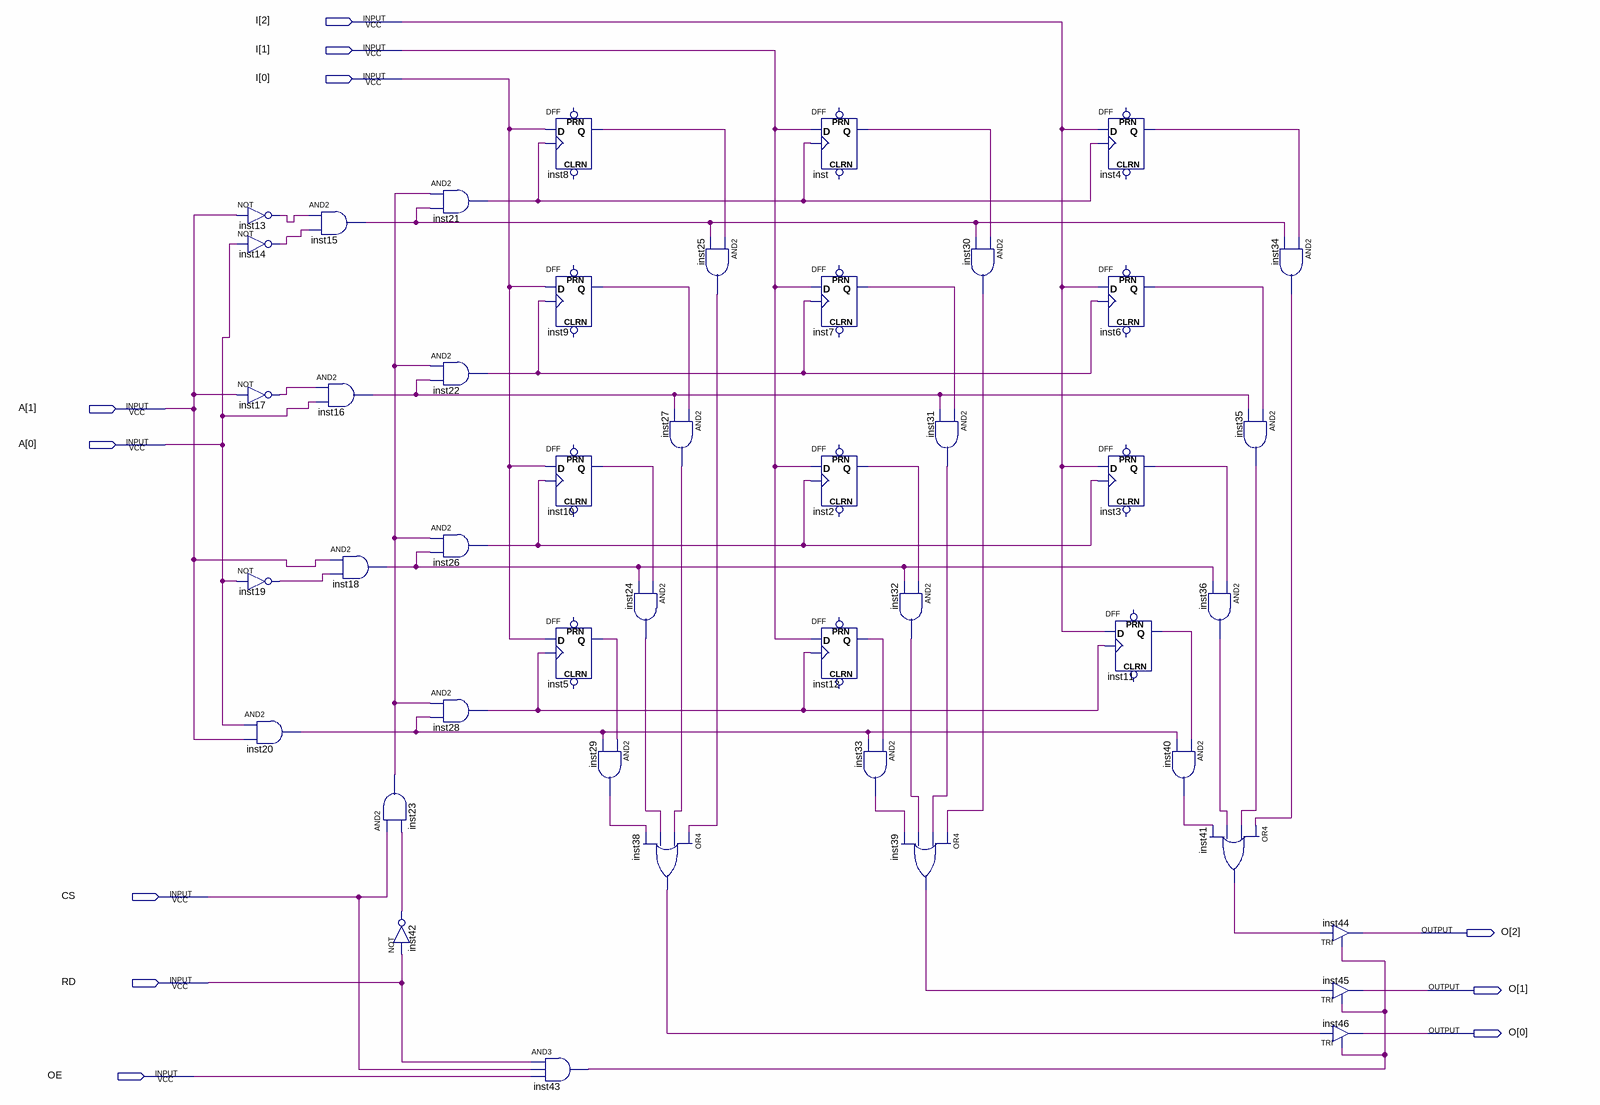
[diagram p0: schematic sheet]
// Quartus schematic MEM_4x3.bdf as structural Verilog: 45 symbols, 11 pins
module MEM_4x3 (
  input  [2:0] I,
  input  [1:0] A,
  input  CS,
  input  RD,
  input  OE,
  output [2:0] O
);

  wire inst2_q, inst3_q, inst4_q, inst5_q, inst6_q, inst7_q, inst8_q, inst9_q, inst10_q, inst11_q, inst12_q,
       inst13_out, inst14_out, inst15_out, inst16_out, inst17_out, inst18_out, inst19_out, inst20_out,
       inst21_out, inst22_out, inst23_out, inst24_out, inst25_out, inst26_out, inst27_out, inst28_out,
       inst29_out, inst30_out, inst31_out, inst32_out, inst33_out, inst34_out, inst35_out, inst36_out,
       inst38_out, inst39_out, inst40_out, inst41_out, inst42_out, inst43_out, inst_q;

  not inst13 (inst13_out, A[1]);
  not inst14 (inst14_out, A[0]);
  not inst17 (inst17_out, A[1]);
  not inst19 (inst19_out, A[0]);
  and inst20 (inst20_out, A[0], A[1]);
  and inst15 (inst15_out, inst13_out, inst14_out);
  and inst16 (inst16_out, inst17_out, A[0]);
  and inst18 (inst18_out, A[1], inst19_out);
  and inst23 (inst23_out, CS, inst42_out);
  and inst21 (inst21_out, inst23_out, inst15_out);
  and inst22 (inst22_out, inst23_out, inst16_out);
  and inst26 (inst26_out, inst23_out, inst18_out);
  and inst28 (inst28_out, inst23_out, inst20_out);
  not inst42 (inst42_out, RD);
  DFF inst8 (.CLK(inst21_out), .D(I[0]), .Q(inst8_q));  // open: CLRN, PRN
  DFF inst9 (.CLK(inst22_out), .D(I[0]), .Q(inst9_q));  // open: CLRN, PRN
  DFF inst10 (.CLK(inst26_out), .D(I[0]), .Q(inst10_q));  // open: CLRN, PRN
  DFF inst5 (.CLK(inst28_out), .D(I[0]), .Q(inst5_q));  // open: CLRN, PRN
  and inst43 (inst43_out, RD, CS, OE);
  and inst29 (inst29_out, inst5_q, inst20_out);
  and inst27 (inst27_out, inst9_q, inst16_out);
  and inst24 (inst24_out, inst10_q, inst18_out);
  or inst38 (inst38_out, inst25_out, inst27_out, inst24_out, inst29_out);
  and inst25 (inst25_out, inst8_q, inst15_out);
  DFF inst (.CLK(inst21_out), .D(I[1]), .Q(inst_q));  // open: CLRN, PRN
  DFF inst7 (.CLK(inst22_out), .D(I[1]), .Q(inst7_q));  // open: CLRN, PRN
  DFF inst2 (.CLK(inst26_out), .D(I[1]), .Q(inst2_q));  // open: CLRN, PRN
  DFF inst12 (.CLK(inst28_out), .D(I[1]), .Q(inst12_q));  // open: CLRN, PRN
  and inst32 (inst32_out, inst2_q, inst18_out);
  and inst33 (inst33_out, inst12_q, inst20_out);
  or inst39 (inst39_out, inst30_out, inst31_out, inst32_out, inst33_out);
  and inst31 (inst31_out, inst7_q, inst16_out);
  and inst30 (inst30_out, inst_q, inst15_out);
  DFF inst4 (.CLK(inst21_out), .D(I[2]), .Q(inst4_q));  // open: CLRN, PRN
  DFF inst6 (.CLK(inst22_out), .D(I[2]), .Q(inst6_q));  // open: CLRN, PRN
  DFF inst3 (.CLK(inst26_out), .D(I[2]), .Q(inst3_q));  // open: CLRN, PRN
  DFF inst11 (.CLK(inst28_out), .D(I[2]), .Q(inst11_q));  // open: CLRN, PRN
  and inst40 (inst40_out, inst11_q, inst20_out);
  and inst35 (inst35_out, inst6_q, inst16_out);
  and inst36 (inst36_out, inst3_q, inst18_out);
  or inst41 (inst41_out, inst34_out, inst35_out, inst36_out, inst40_out);
  and inst34 (inst34_out, inst4_q, inst15_out);
  TRI inst44 (.IN(inst41_out), .OE(inst43_out), .OUT(O[2]));
  TRI inst45 (.IN(inst39_out), .OE(inst43_out), .OUT(O[1]));
  TRI inst46 (.IN(inst38_out), .OE(inst43_out), .OUT(O[0]));
endmodule
